# EAGLE design ha-pc-switch-revB (EAGLE 9.6.2)

## Sheet 1 of 2
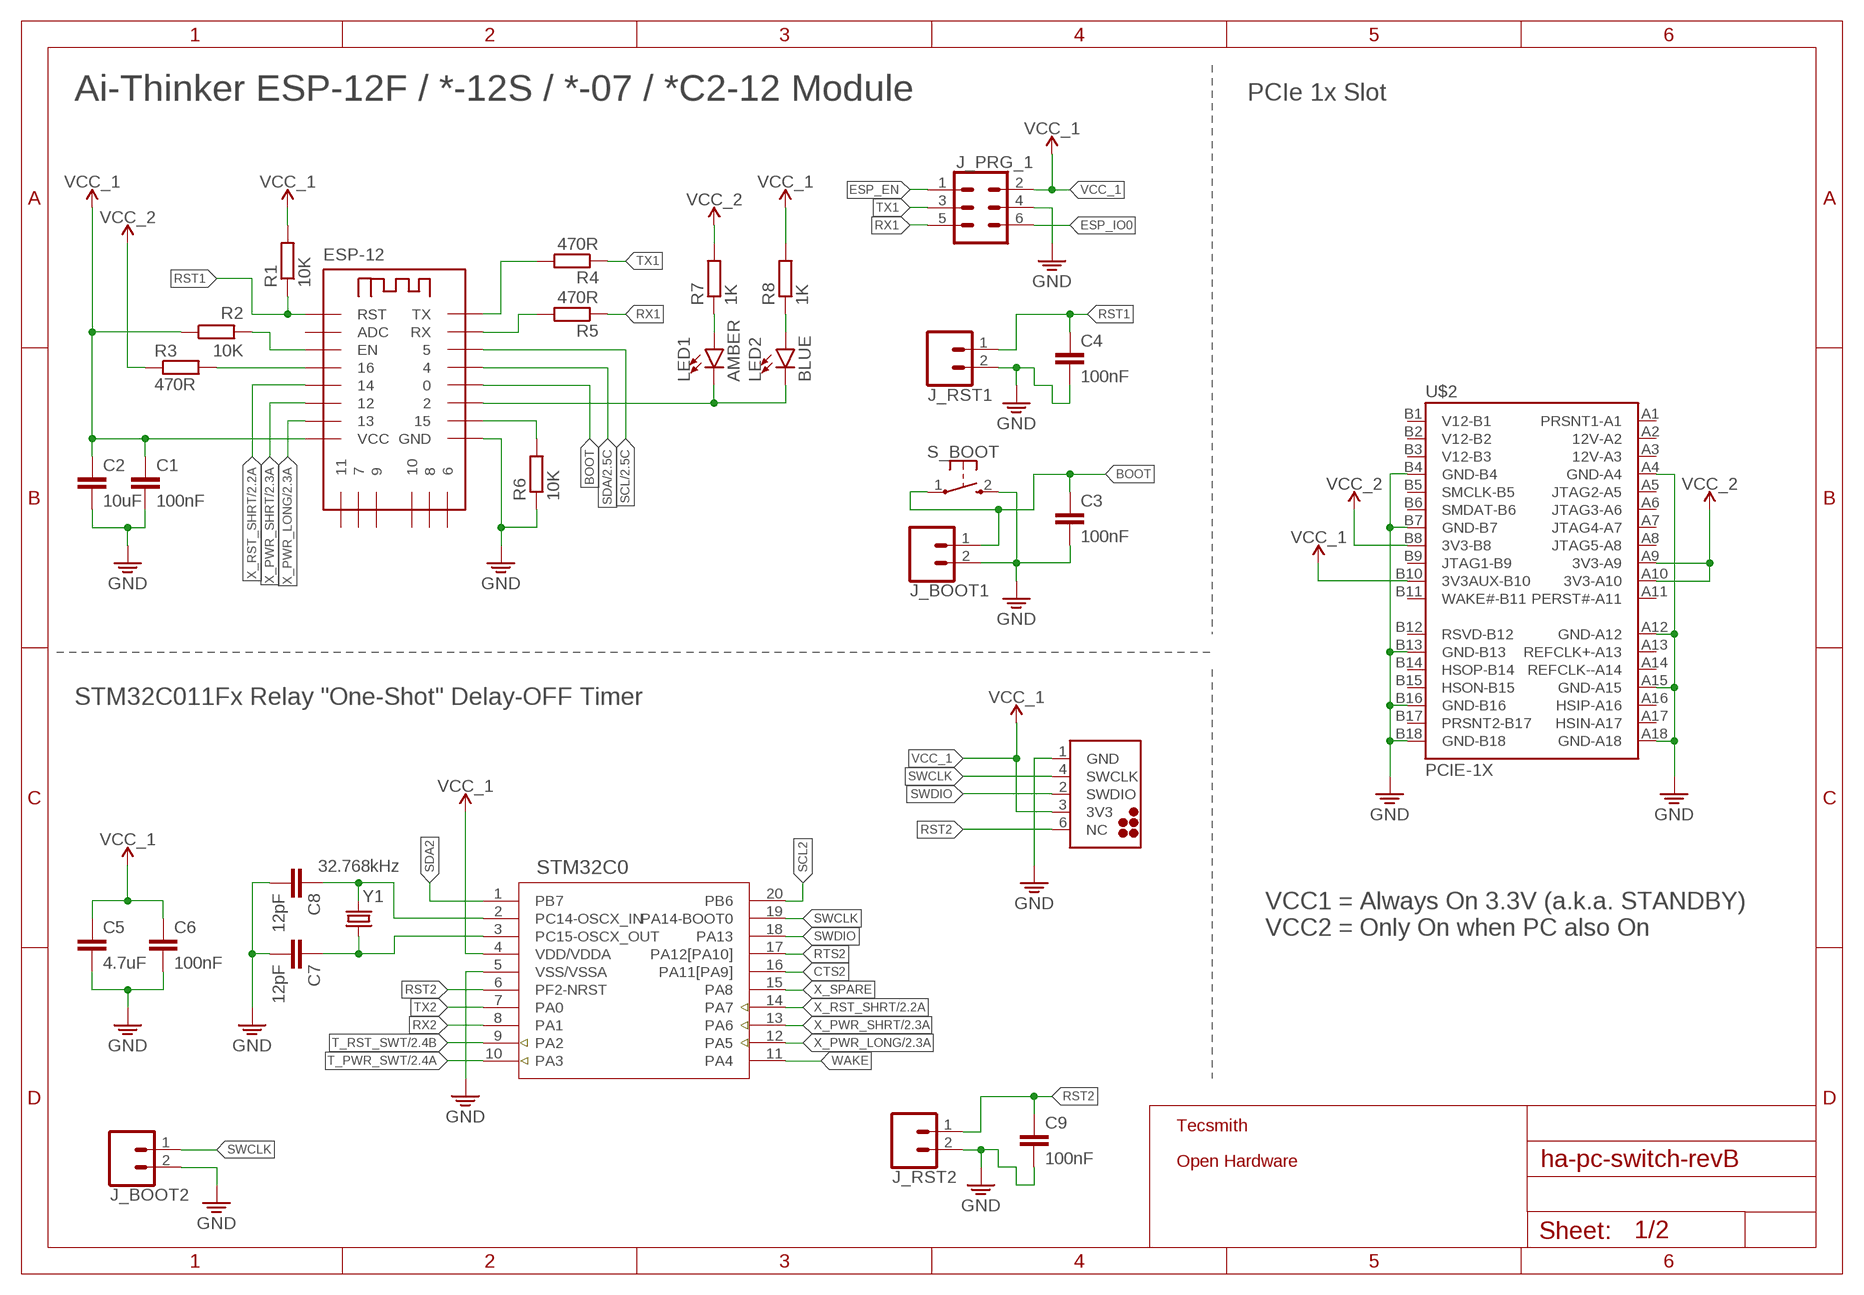
[diagram p0: schematic, sheet 1]

### Parts
C1  100nF  C-EUC0603  [C0603]
C2  10uF  C-EUC0603  [C0603]
C3  100nF  C-EUC0603  [C0603]
C4  100nF  C-EUC0603  [C0603]
C5  4.7uF  C-EUC0603  [C0603]
C6  100nF  C-EUC0603  [C0603]
C7  12pF  C-EUC0603  [C0603]
C8  12pF  C-EUC0603  [C0603]
C9  100nF  C-EUC0603  [C0603]
ESP-12  ESPRESSIF-ESP-12F&ESMD  [ESP8266-ESP-12E]
J_BOOT1  CONN_021X02_NO_SILK  [1X02_NO_SILK]
J_BOOT2  CONN_021X02_NO_SILK  [1X02_NO_SILK]
J_PRG2  NUCLEO_HEADER  [NUCLEO]
J_PRG_1  CONN_03X2NO_SILK  [2X3-NS]
J_RST1  CONN_021X02_NO_SILK  [1X02_NO_SILK]
J_RST2  CONN_021X02_NO_SILK  [1X02_NO_SILK]
LED1  AMBER  LED-GREEN0603  [LED-0603]
LED2  BLUE  LED-GREEN0603  [LED-0603]
LOGO1  OSHW-LOGOM  [OSHW-LOGO-M]
R1  10K  R-EU_R0603  [R0603]
R2  10K  R-EU_R0603  [R0603]
R3  470R  R-EU_R0603  [R0603]
R4  470R  R-EU_R0603  [R0603]
R5  470R  R-EU_R0603  [R0603]
R6  10K  R-EU_R0603  [R0603]
R7  1K  R-EU_R0603  [R0603]
R8  1K  R-EU_R0603  [R0603]
S_BOOT  MOMENTARY-SWITCH-SPST-1  [SKRKAEE020]
STM32C0  STM32C011FTSSOP20_STM-M  [TSSOP20-M]
U$1  TECSMITH-LOGOLONG  [TECSMITH-NAME]
U$2  PCIE-1X  [PCIE-1X]
Y1  32.768kHz  CRYSTAL-32.768KHZSMD-3.2X1.5  [CRYSTAL-SMD-3.2X1.5MM]

### Nets
BOOT: C3.1 ESP-12.GPIO0 J_BOOT1.1 S_BOOT.1
CTS2: STM32C0.16(PA11[PA9])
ESP_EN: ESP-12.EN J_PRG_1.1 R2.2
ESP_IO0: J_PRG_1.6
GND: C1.2 C2.2 C3.2 C4.2 C5.2 C6.2 C7.2 C8.2 C9.2 ESP-12.GND J_BOOT1.2 J_BOOT2.2 J_PRG2.1(GND) J_PRG_1.4 J_RST1.2 J_RST2.2 R6.1 S_BOOT.2 STM32C0.5(VSS/VSSA) U$2.A4(GND-A4) U$2.A12(GND-A12) U$2.A15(GND-A15) U$2.A18(GND-A18) U$2.B4(GND-B4) U$2.B7(GND-B7) U$2.B13(GND-B13) U$2.B16(GND-B16) U$2.B18(GND-B18) ; also sheet 2
N$1: ESP-12.GPIO16 R3.2
N$2: LED2.A R8.1
N$10: C8.1 STM32C0.2(PC14-OSCX_IN) Y1.P$2
N$11: C7.1 STM32C0.3(PC15-OSCX_OUT) Y1.P$1
N$14: LED1.A R7.1
N$15: ESP-12.RXD0(RX) R5.2
N$16: ESP-12.GPIO2 LED1.C LED2.C
N$23: ESP-12.TXD0(TX) R4.2
N$24: ESP-12.GPIO15 R6.2
RST1: C4.1 ESP-12.RST J_RST1.1 R1.1
RST2: C9.1 J_PRG2.6(NC) J_RST2.1 STM32C0.6(PF2-NRST)
RTS2: STM32C0.17(PA12[PA10])
RX1: J_PRG_1.5 R5.1
RX2: STM32C0.8(PA1)
SCL: ESP-12.GPIO5 ; also sheet 2
SCL2: STM32C0.20(PB6)
SDA: ESP-12.GPIO4 ; also sheet 2
SDA2: STM32C0.1(PB7)
SWCLK: J_BOOT2.1 J_PRG2.4(SWCLK) STM32C0.19(PA14-BOOT0)
SWDIO: J_PRG2.2(SWDIO) STM32C0.18(PA13)
T_PWR_SWT: STM32C0.10(PA3) ; also sheet 2
T_RST_SWT: STM32C0.9(PA2) ; also sheet 2
TX1: J_PRG_1.3 R4.1
TX2: STM32C0.7(PA0)
VCC_1: C1.1 C2.1 C5.1 C6.1 ESP-12.VCC J_PRG2.3(3V3) J_PRG_1.2 R1.2 R2.1 R8.2 STM32C0.4(VDD/VDDA) U$2.B10(3V3AUX-B10) ; also sheet 2
VCC_2: R3.1 R7.2 U$2.A9(3V3-A9) U$2.A10(3V3-A10) U$2.B8(3V3-B8)
WAKE: STM32C0.11(PA4)
X_PWR_LONG: ESP-12.GPIO13 STM32C0.12(PA5) ; also sheet 2
X_PWR_SHRT: ESP-12.GPIO12 STM32C0.13(PA6) ; also sheet 2
X_RST_SHRT: ESP-12.GPIO14 STM32C0.14(PA7) ; also sheet 2
X_SPARE: STM32C0.15(PA8)
Unconnected: ESP-12.ADC0(ADC) ESP-12.CS0 ESP-12.GPIO9 ESP-12.GPIO10 ESP-12.MISO ESP-12.MOSI ESP-12.SCLK U$2.A1(PRSNT1-A1) U$2.A2(12V-A2) U$2.A3(12V-A3) U$2.A5(JTAG2-A5) U$2.A6(JTAG3-A6) U$2.A7(JTAG4-A7) U$2.A8(JTAG5-A8) U$2.A11(PERST#-A11) U$2.A13(REFCLK+-A13) U$2.A14(REFCLK--A14) U$2.A16(HSIP-A16) U$2.A17(HSIN-A17) U$2.B1(V12-B1) U$2.B2(V12-B2) U$2.B3(V12-B3) U$2.B5(SMCLK-B5) U$2.B6(SMDAT-B6) U$2.B9(JTAG1-B9) U$2.B11(WAKE#-B11) U$2.B12(RSVD-B12) U$2.B14(HSOP-B14) U$2.B15(HSON-B15) U$2.B17(PRSNT2-B17)

### Notes on the sheet
- Ai-Thinker ESP-12F / *-12S / *-07 / *C2-12 Module | PCIe 1x Slot
- STM32C011Fx Relay "One-Shot" Delay-OFF Timer
- VCC1 = Always On 3.3V (a.k.a. STANDBY)
  VCC2 = Only On when PC also On

## Sheet 2 of 2
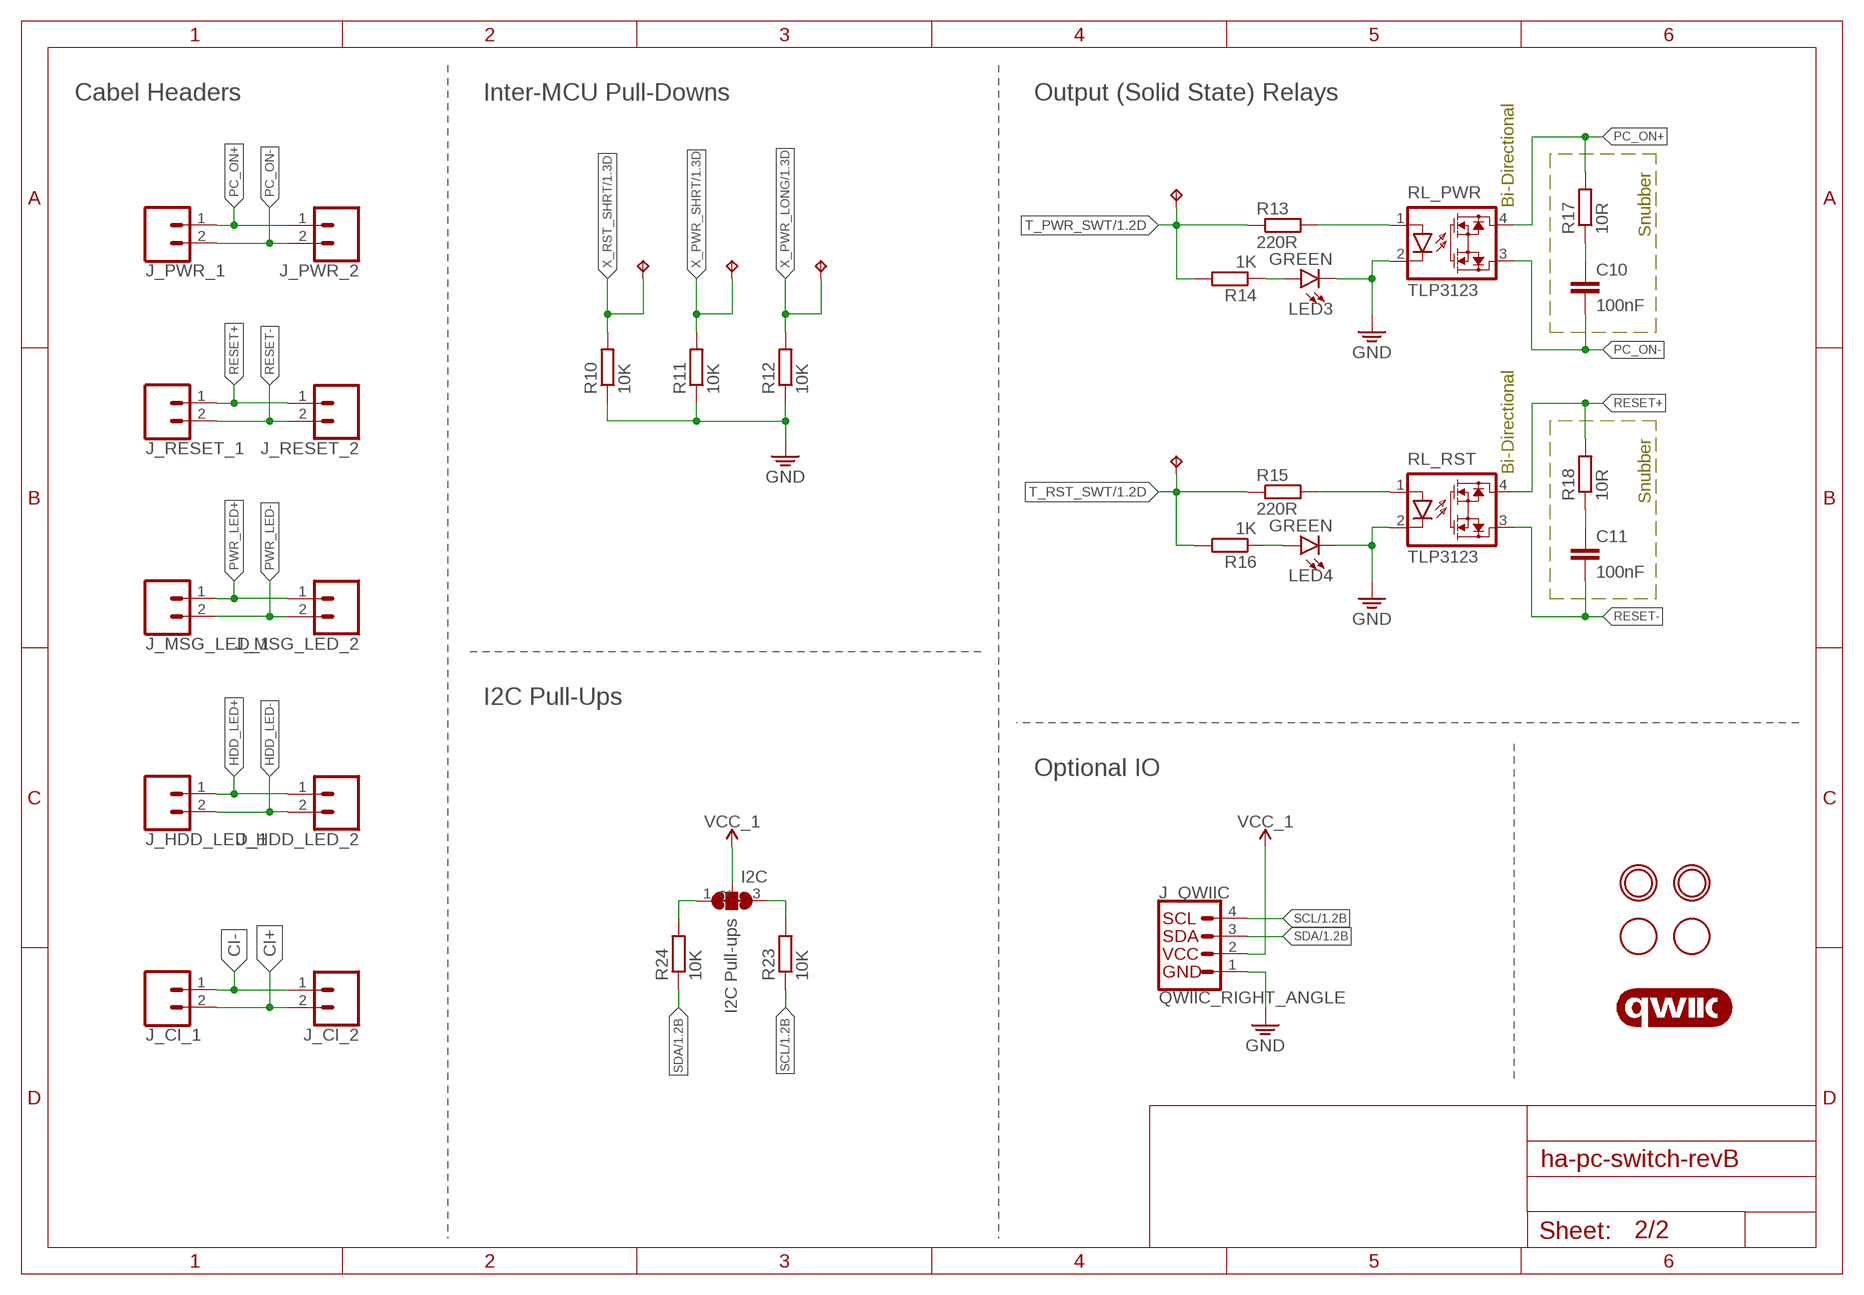
[diagram p1: schematic, sheet 2]

### Parts
C10  100nF  C-EUC0603  [C0603]
C11  100nF  C-EUC0603  [C0603]
I2C  JUMPER-1X3-CLOSED-2  [SOLDERJUMPER_CLOSEDWIRE-3-2]
J_CI_1  CONN_021X02_NO_SILK  [1X02_NO_SILK]
J_CI_2  CONN_021X02_NO_SILK  [1X02_NO_SILK]
J_HDD_LED_1  CONN_021X02_NO_SILK  [1X02_NO_SILK]
J_HDD_LED_2  CONN_021X02_NO_SILK  [1X02_NO_SILK]
J_MSG_LED_1  CONN_021X02_NO_SILK  [1X02_NO_SILK]
J_MSG_LED_2  CONN_021X02_NO_SILK  [1X02_NO_SILK]
J_PWR_1  CONN_021X02_NO_SILK  [1X02_NO_SILK]
J_PWR_2  CONN_021X02_NO_SILK  [1X02_NO_SILK]
J_QWIIC  QWIIC_RIGHT_ANGLE  QWIIC_CONNECTORJS-1MM  [JST04_1MM_RA]
J_RESET_1  CONN_021X02_NO_SILK  [1X02_NO_SILK]
J_RESET_2  CONN_021X02_NO_SILK  [1X02_NO_SILK]
LED3  GREEN  LED-GREEN0603  [LED-0603]
LED4  GREEN  LED-GREEN0603  [LED-0603]
LOGO2  QWIIC_LOGO_4MM  [QWIIC_4MM]
R10  10K  R-EU_R0603  [R0603]
R11  10K  R-EU_R0603  [R0603]
R12  10K  R-EU_R0603  [R0603]
R13  220R  R-EU_R0603  [R0603]
R14  1K  R-EU_R0603  [R0603]
R15  220R  R-EU_R0603  [R0603]
R16  1K  R-EU_R0603  [R0603]
R17  10R  R-EU_R0603  [R0603]
R18  10R  R-EU_R0603  [R0603]
R23  10K  R-EU_R0603  [R0603]
R24  10K  R-EU_R0603  [R0603]
RL_PWR  TLP3123  [SOP4_TOS]
RL_RST  TLP3123  [SOP4_TOS]
TP6  TPTP16SQ  [TP16SQ]
TP7  TPTP16SQ  [TP16SQ]
TP8  TPTP16SQ  [TP16SQ]
TP9  TPTP16SQ  [TP16SQ]
TP10  TPTP16SQ  [TP16SQ]
U$9  MOUNTINGHOLE3.0THIN  [MOUNTINGHOLE_3.0_PLATEDTHIN]
U$11  MOUNTINGHOLE3.0THIN  [MOUNTINGHOLE_3.0_PLATEDTHIN]
U$15  FIDUCIAL  [FIDUCIAL_1MM]
U$16  FIDUCIAL  [FIDUCIAL_1MM]

### Nets
CI+: J_CI_1.2 J_CI_2.2
CI-: J_CI_1.1 J_CI_2.1
GND: J_QWIIC.1 LED3.C LED4.C R10.1 R11.1 R12.1 RL_PWR.2(C) RL_RST.2(C) ; also sheet 1
HDD_LED+: J_HDD_LED_1.1 J_HDD_LED_2.1
HDD_LED-: J_HDD_LED_1.2 J_HDD_LED_2.2
N$5: R15.2 RL_RST.1(A)
N$7: C10.1 R17.1
N$8: C11.1 R18.1
N$9: R13.2 RL_PWR.1(A)
N$19: LED3.A R14.1
N$20: I2C.3 R23.2
N$21: I2C.1 R24.2
N$25: LED4.A R16.1
PC_ON+: J_PWR_1.1 J_PWR_2.1 R17.2 RL_PWR.4(D1)
PC_ON-: C10.2 J_PWR_1.2 J_PWR_2.2 RL_PWR.3(D2)
PWR_LED+: J_MSG_LED_1.1 J_MSG_LED_2.1
PWR_LED-: J_MSG_LED_1.2 J_MSG_LED_2.2
RESET+: J_RESET_1.1 J_RESET_2.1 R18.2 RL_RST.4(D1)
RESET-: C11.2 J_RESET_1.2 J_RESET_2.2 RL_RST.3(D2)
SCL: J_QWIIC.4 R23.1 ; also sheet 1
SDA: J_QWIIC.3 R24.1 ; also sheet 1
T_PWR_SWT: R13.1 R14.2 TP9.TP ; also sheet 1
T_RST_SWT: R15.1 R16.2 TP10.TP ; also sheet 1
VCC_1: I2C.2 J_QWIIC.2 ; also sheet 1
X_PWR_LONG: R12.2 TP8.TP ; also sheet 1
X_PWR_SHRT: R11.2 TP7.TP ; also sheet 1
X_RST_SHRT: R10.2 TP6.TP ; also sheet 1

### Notes on the sheet
- Cabel Headers | Inter-MCU Pull-Downs | Output (Solid State) Relays
- Snubber
- Bi-Directional
- Snubber
- Bi-Directional
- I2C Pull-Ups
- Optional IO
- I2C Pull-ups

## Library data of the parts
C1-C11 = rcl:C-EU: CAPACITOR, European symbol; SPICEPREFIX: C
ESP-12 = ts_dev_boards:ESPRESSIF-ESP-12F&E: ESP12E Module
I2C = ts_jumpers:JUMPER-1X3-CLOSED-2
J_BOOT1 J_BOOT2 J_CI_1 J_CI_2 J_HDD_LED_1 J_HDD_LED_2 J_MSG_LED_1 J_MSG_LED_2 J_PWR_1 J_PWR_2 J_RESET_1 J_RESET_2 J_RST1 J_RST2 = SparkFun-Connectors:CONN_02: Multi connection point. Often used as Generic Header-pin footprint for 0.1 inch spaced/style header connections On any of the 0.1 inch spaced packages, you can populate with these: Break Away Headers - Straight <https://www.sparkfun.com/products/116> (PRT-00116) Break Away Male Headers - Right Angle <https://www.sparkfun.com/products/553> (PRT-00553) Female Headers <https://www.sparkfun.com/products/115> (PRT-00115) Break Away Headers - Machine Pin <https://www.sparkfun.com/products/117> (PRT-00117) Break Away Female Headers - Swiss Machine Pin <https://www.sparkfun.com/products/743> (PRT-00743) For SCREWTERMINALS and SPRING TERMINALS visit here: Screw Terimnals on SparkFun.com <https://www.sparkfun.com/search/results?term=Screw+Terminals> (5mm/3.5mm/2.54mm spacing) This device is also useful as a general connection point to wire up your design to another part of your project. Our various solder wires solder well into these plated through hole pads. Hook-Up Wire - Assortment (Stranded, 22 AWG) <https://www.sparkfun.com/products/11375> (PRT-11375) Hook-Up Wire - Assortment (Solid Core, 22 AWG) <https://www.sparkfun.com/products/11367> (PRT-11367) View the entire wire category on our website here <https://www.sparkfun.com/categories/141> Special notes: Molex polarized connector foot print use with: PRT-08233 with associated crimp pins and housings. 2.54_SCREWTERM for use with PRT-10571. 3.5mm Screw Terminal footprints for PRT-08084 5mm Screw Terminal footprints for use with PRT-08432
J_PRG2 = stm32c0:NUCLEO_HEADER
J_PRG_1 = SparkFun-Connectors:CONN_03X2: Multi connection point. Often used as Generic Header-pin footprint for 0.1 inch spaced/style header connections You can populate with any combo of single row headers, but if you'd like an exact match, check these: Header - 2x3 (Male, 0.1") <https://www.sparkfun.com/products/12807> (PRT-12807) Header - 2x3 (Female, 0.1") <https://www.sparkfun.com/products/13010> (PRT-13010) 2x3 Pin Shrouded Header <https://www.sparkfun.com/products/10877> (PRT-10877) On any of the 0.1 inch spaced packages, you can populate with these: Break Away Headers - Straight <https://www.sparkfun.com/products/116> (PRT-00116) Break Away Male Headers - Right Angle <https://www.sparkfun.com/products/553> (PRT-00553) Female Headers <https://www.sparkfun.com/products/115> (PRT-00115) Break Away Headers - Machine Pin <https://www.sparkfun.com/products/117> (PRT-00117) Break Away Female Headers - Swiss Machine Pin <https://www.sparkfun.com/products/743> (PRT-00743) Special note: the shrouded connector mates well with our 3x2 ribbon cables: Ribbon Crimp Connector - 6-pin (2x3, Female) <https://www.sparkfun.com/products/10651> (PRT-10651) Ribbon Cable - 6 wire (15ft) <https://www.sparkfun.com/products/10646> (PRT-10646)
J_QWIIC = ts_custom_nick_nacks:QWIIC_CONNECTOR: SparkFun I2C Standard Qwiic Connector An SMD 1mm pitch JST connector makes it easy and quick (get it? Qwiic?) to connect I2C devices to each other. The Qwiic system <http://www.sparkfun.com/qwiic> enables fast and solderless connection between popular platforms and various sensors and actuators. We carry 200mm <https://www.sparkfun.com/products/14204>, 100mm <https://www.sparkfun.com/products/14205>, 50mm <https://www.sparkfun.com/products/14206>, and breadboard friendly <https://www.sparkfun.com/products/14207> Qwiic cables. We also offer 10 pcs strips <https://www.sparkfun.com/products/14323> the SMD connectors.; PROD_ID: CONN-13694
LED1 LED2 = SparkFun-LED:LED-GREEN: Green SMD LED Used in manufacturing of various products at SparkFun Packages: 0603 - SMD 0603 package [Product Link] <http://www.futureelectronics.com/en/technologies/semiconductors/optoelectronics/leds/Pages/9894312-LTST-C190GKT.aspx?CrossPart=HSMG-C190&IM=0> LilyPad 1206 - SMD1206 LilyPad package [Product Link] <http://www.futureelectronics.com/en/Technologies/Product.aspx?ProductID=IN150NGHARVATEKCORPORATION2049943&IM=0> 1206 - SMD1206 package [Product Link] <http://www.futureelectronics.com/en/technologies/semiconductors/optoelectronics/leds/Pages/8315665-LTST-C150KGKT.aspx?IM=0> 1206 Bottom Mount -SMD 1206 Bottom Mount [Product Link] <http://www.digikey.com/product-detail/en/lite-on-inc/LTST-C230KGKT/160-1456-1-ND/386854> SparkFun Products: Pro Mini 328 -5V <https://www.sparkfun.com/products/821> RedBoard <https://www.sparkfun.com/products/12757> MP3 Trigger <https://www.sparkfun.com/products/13720> Makey Makey <https://www.sparkfun.com/products/11076>; PROD_ID: DIO-00821; VALUE: GREEN
LED3 LED4 = SparkFun-LED:LED-GREEN: Green SMD LED Used in manufacturing of various products at SparkFun Packages: 0603 - SMD 0603 package [Product Link] <http://www.futureelectronics.com/en/technologies/semiconductors/optoelectronics/leds/Pages/9894312-LTST-C190GKT.aspx?CrossPart=HSMG-C190&IM=0> LilyPad 1206 - SMD1206 LilyPad package [Product Link] <http://www.futureelectronics.com/en/Technologies/Product.aspx?ProductID=IN150NGHARVATEKCORPORATION2049943&IM=0> 1206 - SMD1206 package [Product Link] <http://www.futureelectronics.com/en/technologies/semiconductors/optoelectronics/leds/Pages/8315665-LTST-C150KGKT.aspx?IM=0> 1206 Bottom Mount -SMD 1206 Bottom Mount [Product Link] <http://www.digikey.com/product-detail/en/lite-on-inc/LTST-C230KGKT/160-1456-1-ND/386854> SparkFun Products: Pro Mini 328 -5V <https://www.sparkfun.com/products/821> RedBoard <https://www.sparkfun.com/products/12757> MP3 Trigger <https://www.sparkfun.com/products/13720> Makey Makey <https://www.sparkfun.com/products/11076>; PROD_ID: DIO-00821
LOGO1 = random_logos:OSHW-LOGO: Open-Source Hardware (OSHW) Logo This logo indicates the piece of hardware it is found on incorporates a OSHW license and/or adheres to the definition of open source hardware found here: http://freedomdefined.org/OSHW
LOGO2 = SparkFun-Aesthetics:QWIIC_LOGO: Qwiic Logos for placement on schematic and PCB. The 5.5mm silk logo is best for placing next to Qwiic connector.
R1-R8 R10-R18 R23 R24 = rcl:R-EU_: RESISTOR, European symbol; SPICEPREFIX: R
RL_PWR RL_RST = __untitled:TLP3123
S_BOOT = ts_custom_nick_nacks:MOMENTARY-SWITCH-SPST-1: Momentary Switch (Pushbutton) - SPST - Two Circuits Normally-open (NO) SPST momentary switches (buttons, pushbuttons). Schematic symbol includes two switch circuits. Variants SMD-4.6MMX2.8MM - 4.60mm x 2.80mm Tactile Momentary Button Switch - Used on SparkFun SAMD21 Mini Breakout <https://www.sparkfun.com/products/13664> SMD-5.2MM - Mini Pushbutton Switch - SMD <https://www.sparkfun.com/products/8720> - Used on Arduino Pro Mini <https://www.sparkfun.com/products/11114>
STM32C0 = stm32c0:STM32C011F; COPYRIGHT: Copyright (C) 2024 Ultra Librarian. All rights reserved.; MANUFACTURER_PART_NUMBER: STM32C011F4P6; MFR_NAME: STMicroelectronics
TP6-TP10 = testpad:TP: Test pad
U$1 = random_logos:TECSMITH-LOGO
U$2 = ts-pcie:PCIE-1X
U$9 U$11 = ts_custom_nick_nacks:MOUNTINGHOLE: Mounting Hole For #2 screws (0.086"/2.18mm width, 0.094"/2.4mm hole) use 2.5mm; BOM: EXCLUDE
U$15 U$16 = adafruit:FIDUCIAL: For use by pick and place machines to calibrate the vision/machine, 1mm By microbuilder.eu
Y1 = SparkFun-Clocks:CRYSTAL-32.768KHZ: 32.768kHz Crystal Frequency: 32.768kHz Frequency Stability: ±20ppm Load Capacitance: 12.5pF (PTH-2X6 & SMD-3.2X1.5), 6pF (SMD-2X6) SparkFun Products: SparkFun BigTime Watch Kit <https://www.sparkfun.com/products/11734> SparkFun nRF52832 Breakout <https://www.sparkfun.com/products/13990> SparkFun Real Time Clock Module <https://www.sparkfun.com/products/12708>; PROD_ID: XTAL-13062

## Board
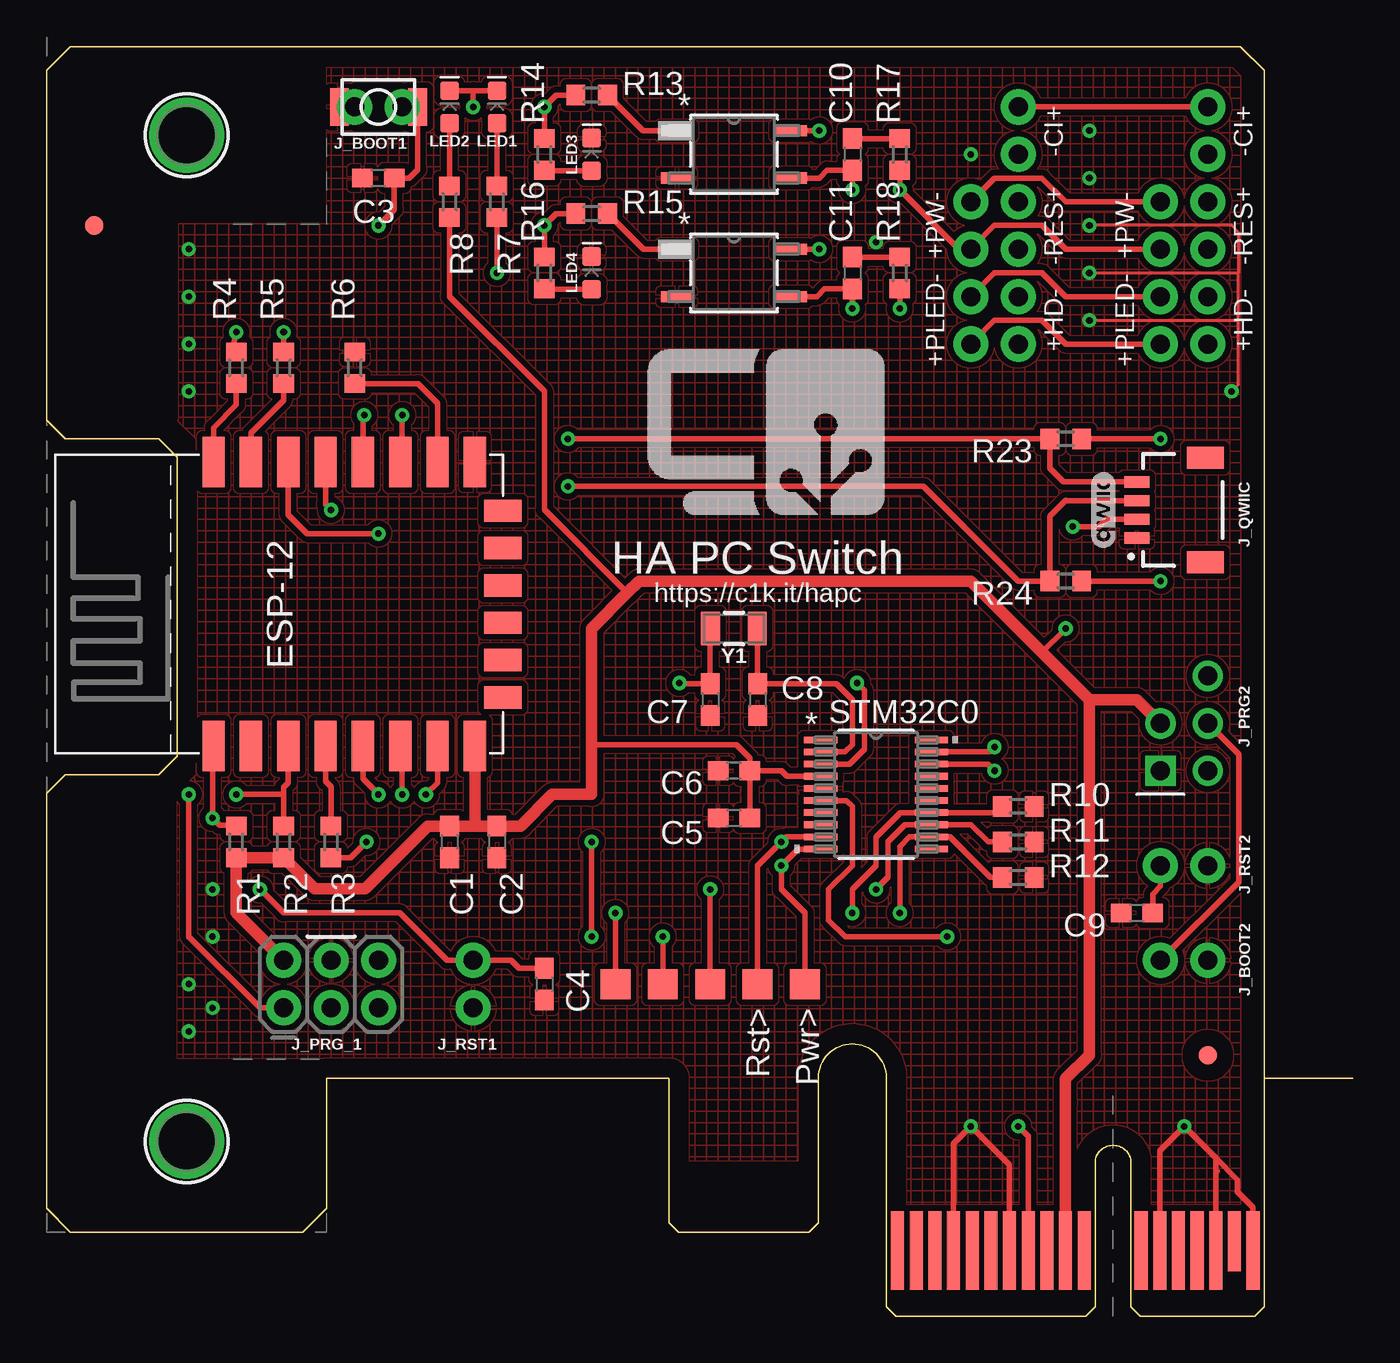
[diagram p2: board, top side]
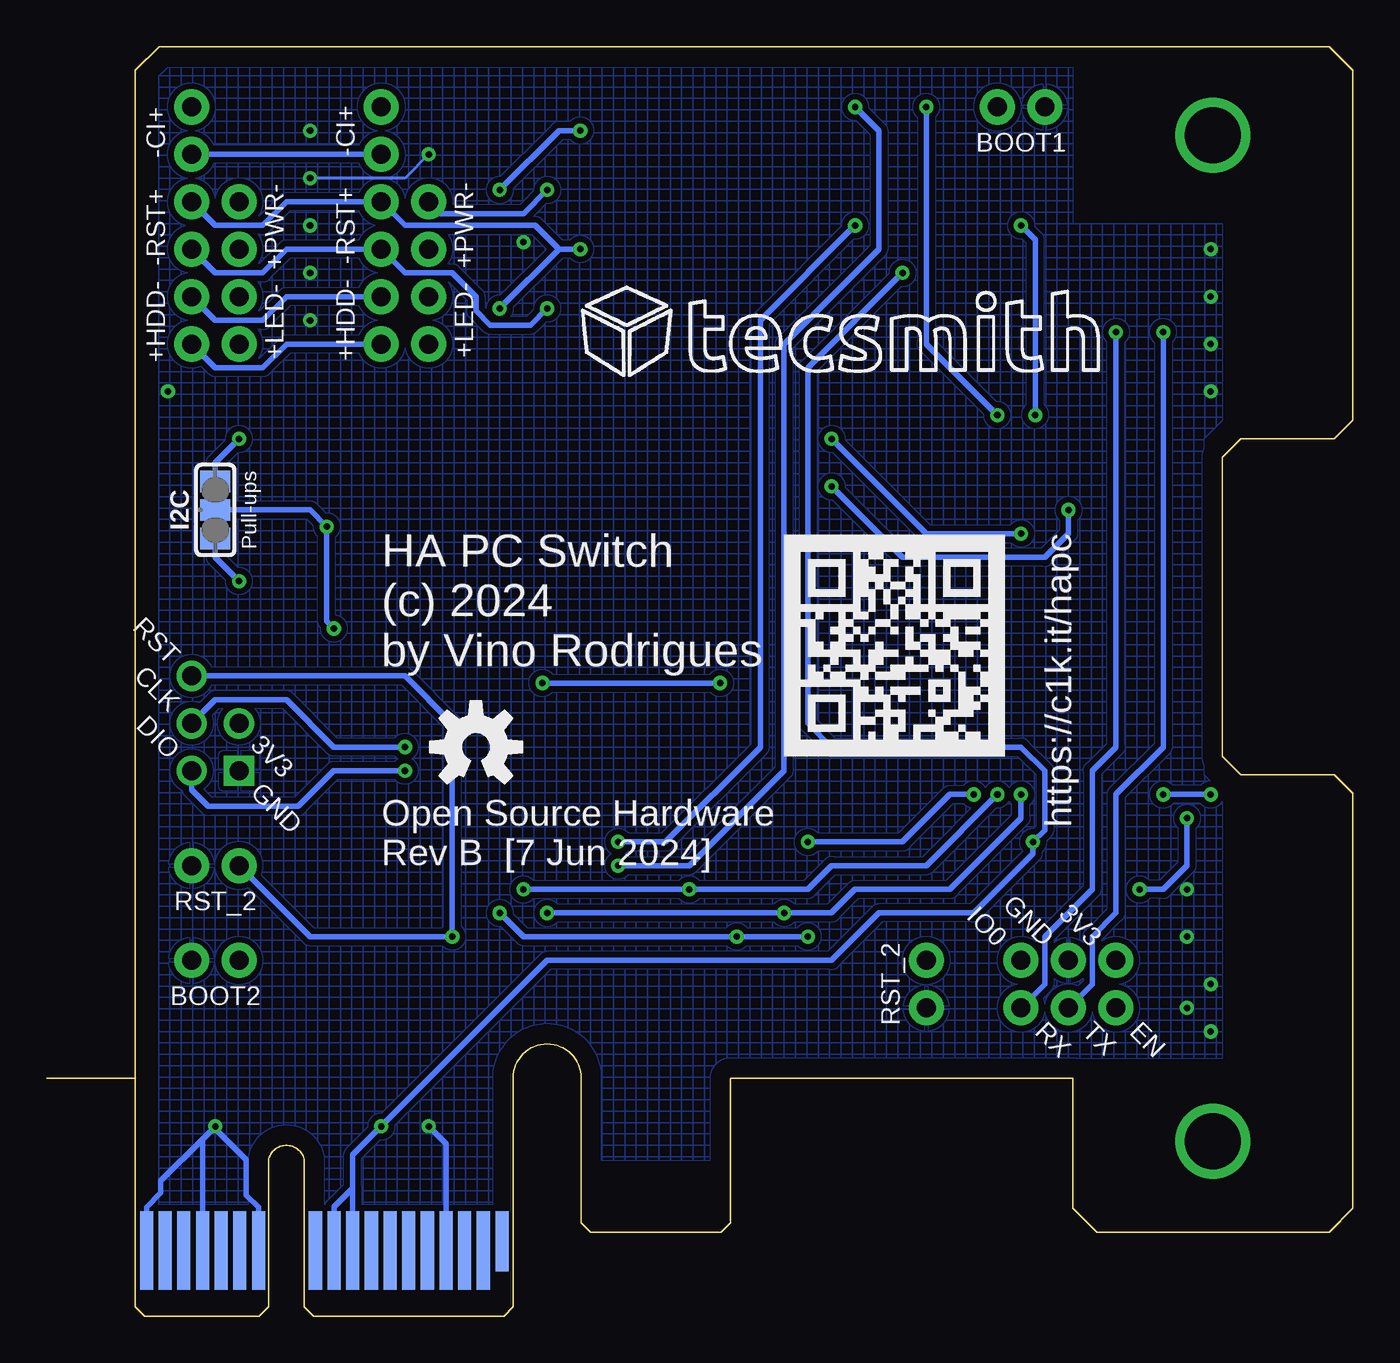
[diagram p3: board, bottom side, seen from below]

Size 70 x 68 mm. Coordinates in mm from the lower left corner, seen from the top.
Outline: 65.25,12.75 65.25,66.73 63.98,68 1.27,68 0,66.73 0,48 1,47 6,47 7,46 7,30 6,29 1,29 0,28 0,5.77 1.27,4.5 13.73,4.5 15,5.77 15,12.75 33.35,12.75 33.35,5 33.85,4.5 40.85,4.5 41.35,5 41.35,12.75 arc-180 45,12.75 45,0.5 45.5,0 55.7,0 56.2,0.5 56.2,8.4 arc-152 58.1,8.4 58.1,0.5 58.6,0 64.75,0 65.25,0.5 65.25,12.75
Outline: 65.25,12.75 70,12.75
Copper layers (1*16): Top 0.035mm / dielectric 1.5mm / Bottom 0.035mm
Design rules "default": minimum track width 6mil, minimum drill 0.35mm, track to track 6mil, track to pad 6mil, pad to pad 6mil, via to via 6mil, smd to smd 6mil, copper to edge 40mil, drill to drill 6mil, minimum pad ring 10mil, minimum via ring 8mil, stop-mask expansion 4mil, vias tented up to drill 0mil, thermal gap 10mil

### Footprints (pad centres in the part's own frame; a part is rotated, then mirrored left to right if it is on the bottom)
C0603 = smd 1.1 x 1: 1 -0.85,0; 2 0.85,0
ESP8266-ESP-12E = smd 2.7 x 1.2: ADC0 -7.6,3.5; EN -7.6,1.5; GND 7.6,-8.5; GPIO0 7.6,-2.5; GPIO2 7.6,-4.5; GPIO4 7.6,-0.5; GPIO5 7.6,1.5; GPIO12 -7.6,-4.5; GPIO13 -7.6,-6.5; GPIO14 -7.6,-2.5; GPIO15 7.6,-6.5; GPIO16 -7.6,-0.5; RST -7.6,5.5; RXD0 7.6,3.5; TXD0 7.6,5.5; VCC -7.6,-8.5 | smd 1.2 x 2: CS0 -5,-10; GPIO9 -1,-10; GPIO10 1,-10; MISO -3,-10; MOSI 3,-10; SCLK 5,-10
SOLDERJUMPER_CLOSEDWIRE-3-2 = smd 1.168 x 1.6: 1 -1.524,0; 2 0,0; 3 1.524,0 | smd 0.635 x 0.203: WIRE1 -0.762,0; WIRE2 0.762,0
1X02_NO_SILK = drill 1.016 pad 1.88: 1 0,0; 2 2.54,0
NUCLEO = drill 1.016 pad 1.626 square: 1 -1.27,-1.27 | drill 1.016 pad 1.626: 2 1.27,-1.27; 3 -1.27,1.27; 4 1.27,1.27; 6 1.27,3.81
2X3-NS = drill 1.016 pad 1.88: 1 -2.54,-1.27; 2 -2.54,1.27; 3 0,-1.27; 4 0,1.27; 5 2.54,-1.27; 6 2.54,1.27
JST04_1MM_RA = smd 0.6 x 1.35: 1 -1.5,0; 2 -0.5,0; 3 0.5,0; 4 1.5,0 | smd 1.2 x 2: NC1 2.8,-3.675; NC2 -2.8,-3.675
LED-0603 = smd 1 x 1: A -0.877,0; C 0.877,0
R0603 = smd 1 x 1.1: 1 -0.85,0; 2 0.85,0
SOP4_TOS = smd 1.7 x 0.6: 1 -3.061,1.27; 2 -3.061,-1.27; 3 3.061,-1.27; 4 3.061,1.27
SKRKAEE020 = smd 1 x 2: 1 -2.1,0; 2 2.1,0
TSSOP20-M = smd 1.778 x 0.356: 1 -2.972,2.925; 2 -2.972,2.275; 3 -2.972,1.625; 4 -2.972,0.975; 5 -2.972,0.325; 6 -2.972,-0.325; 7 -2.972,-0.975; 8 -2.972,-1.625; 9 -2.972,-2.275; 10 -2.972,-2.925; 11 2.972,-2.925; 12 2.972,-2.275; 13 2.972,-1.625; 14 2.972,-0.975; 15 2.972,-0.325; 16 2.972,0.325; 17 2.972,0.975; 18 2.972,1.625; 19 2.972,2.275; 20 2.972,2.925
TP16SQ = smd 1.6 x 1.6: TP 0,0
PCIE-1X = smd 0.7 x 3.2 bottom: A1 45.6,4 | smd 0.7 x 4.2 bottom: A2 46.6,3.5; A3 47.6,3.5; A4 48.6,3.5; A5 49.6,3.5; A6 50.6,3.5; A7 51.6,3.5; A8 52.6,3.5; A9 53.6,3.5; A10 54.6,3.5; A11 55.6,3.5; A12 58.65,3.5; A13 59.65,3.5; A14 60.65,3.5; A15 61.65,3.5; A16 62.65,3.5; A17 63.65,3.5; A18 64.65,3.5 | smd 0.7 x 4.2: B1 45.6,3.5; B2 46.6,3.5; B3 47.6,3.5; B4 48.6,3.5; B5 49.6,3.5; B6 50.6,3.5; B7 51.6,3.5; B8 52.6,3.5; B9 53.6,3.5; B10 54.6,3.5; B11 55.6,3.5; B12 58.65,3.5; B13 59.65,3.5; B14 60.65,3.5; B15 61.65,3.5; B16 62.65,3.5; B18 64.65,3.5 | smd 0.7 x 3.2: B17 63.65,4
MOUNTINGHOLE_3.0_PLATEDTHIN = drill 3 pad 3.6: P$1 0,0
FIDUCIAL_1MM = smd 1 x 1: 1 0,0
CRYSTAL-SMD-3.2X1.5MM = smd 1 x 1.8: P$1 -1.25,0; P$2 1.25,0

### Placement (x,y rotation side)
C1  21.59,25.4 270 top
C2  24.13,25.4 270 top
C3  17.78,60.96 180 top
C4  26.67,17.78 270 top
C5  36.83,26.67 180 top
C6  36.83,29.21 180 top
C7  35.56,33.02 270 top
C8  38.1,33.02 270 top
C9  58.42,21.59 180 top
C10  43.18,62.23 270 top
C11  43.18,55.88 270 top
ESP-12  14.45,38.14 90 top
I2C  60.96,43.18 90 bottom
J_BOOT1  19.05,64.77 180 top
J_BOOT2  59.69,19.05 0 top
J_CI_1  62.23,62.23 90 top
J_CI_2  52.07,62.23 90 top
J_HDD_LED_1  62.23,52.07 90 top
J_HDD_LED_2  52.07,52.07 90 top
J_MSG_LED_1  59.69,52.07 90 top
J_MSG_LED_2  49.53,52.07 90 top
J_PRG2  60.96,30.48 0 top
J_PRG_1  15.24,17.78 0 top
J_PWR_1  49.53,57.15 90 top
J_PWR_2  59.69,57.15 90 top
J_QWIIC  58.42,43.18 90 top
J_RESET_1  52.07,59.69 270 top
J_RESET_2  62.23,59.69 270 top
J_RST1  22.86,19.05 270 top
J_RST2  59.69,24.13 0 top
LED1  24.13,64.77 90 top
LED2  21.59,64.77 90 top
LED3  29.21,62.23 90 top
LED4  29.21,55.88 90 top
LOGO1  46.99,30.48 0 bottom
LOGO2  56.64,43.18 90 top
R1  10.16,25.4 270 top
R2  12.7,25.4 90 top
R3  15.24,25.4 90 top
R4  10.16,50.8 270 top
R5  12.7,50.8 270 top
R6  16.51,50.8 270 top
R7  24.13,59.69 270 top
R8  21.59,59.69 270 top
R10  52.07,27.3 180 top
R11  52.07,25.4 180 top
R12  52.07,23.5 180 top
R13  29.21,65.41 0 top
R14  26.67,62.23 90 top
R15  29.21,59.05 0 top
R16  26.67,55.88 90 top
R17  45.72,62.23 270 top
R18  45.72,55.88 270 top
R23  54.61,46.99 0 top
R24  54.61,39.37 0 top
RL_PWR  36.83,62.23 0 top
RL_RST  36.83,55.88 0 top
S_BOOT  17.78,64.77 180 top
STM32C0  44.45,27.94 0 top
TP6  30.48,17.78 0 top
TP7  35.56,17.78 0 top
TP8  33.02,17.78 0 top
TP9  40.64,17.78 0 top
TP10  38.1,17.78 0 top
U$1  38.92,52.87 0 bottom
U$2  0,0 0 top
U$9  7.5,9.35 0 top
U$11  7.5,63.25 0 top
U$15  62.23,13.97 0 top
U$16  2.54,58.42 0 top
Y1  36.83,36.83 0 top

### Tracks (layer width: path | path; a pad name or v marks a point on that pad's centre or on a via)
BOOT  (via drill 0.35)
  Top 0.305: J_BOOT1.1 S_BOOT.1 19.88,61.41 19.43,60.96 C3.1 18.63,59.27 v17.78,58.42 | ESP-12.GPIO0 16.95,48.19 v17.02,48.26
  Bottom 0.305: v17.02,48.26 17.02,57.66 v17.78,58.42
CI+
  Top 0.305: J_CI_2.2 J_CI_1.2
CI-
  Bottom 0.305: J_CI_2.1 J_CI_1.1
ESP_EN  (via drill 0.35)
  Top 0.305: ESP-12.EN 12.95,28.57 12.7,28.32 12.7,27.94 | 12.7,27.94 R2.2 | J_PRG_1.1 11.43,16.51 7.62,20.32 v7.62,27.94 | v10.16,27.94 12.7,27.94
  Bottom 0.305: v7.62,27.94 v10.16,27.94
GND  (via drill 0.35)
  Top 0.152: v63.5,49.53 63.87,49.9 63.87,53.34 | v55.88,58.42 63.5,58.42 63.88,58.04 63.88,55.88 v55.88,55.88 | 63.87,53.34 63.87,55.88 | v55.88,53.34 63.87,53.34
  Top 0.305: U$2.B18 64.65,5.83 63.82,6.67 63.82,7.3 62.65,8.47 | 16.38,64.77 S_BOOT.2 | U$2.B4 48.6,9.23 v49.53,10.16 51.6,8.09 U$2.B7 | 62.65,8.47 v60.96,10.16 59.65,8.85 U$2.B13 | U$2.B16 62.65,7.75 | 62.65,7.75 62.65,8.47 | 62.74,7.75 62.65,7.75
  Bottom 0.152: 61.59,6.35 61.65,6.29 61.7,6.35 | v49.53,62.23 50.8,60.96 v55.88,60.96
  Bottom 0.305: U$2.A15 61.65,6.29 61.65,9.47 | v49.53,10.16 48.6,9.23 U$2.B4 | v60.96,10.16 60.96,10.03 | 60.96,10.03 59.31,8.38 59.31,6.48 58.65,5.82 U$2.A12 | 61.65,9.47 63.88,7.24 63.88,6.6 64.65,5.83 U$2.B18 | 60.96,10.03 61.09,10.03 61.65,9.47
  other vias: 44.45,57.53 55.88,63.5 7.62,57.15 7.62,54.61 7.62,52.07 7.62,49.53 8.89,16.51 8.89,22.86 8.89,20.32 7.62,17.78 7.62,15.24
  pour Top (isolate 0.305, hatched): 15,67 64,67 64,6 58.49,6 58.49,9.24 55.76,9.24 55.76,6 45.37,6 45.37,14.62 41,14.62 41,8.1 33.7,8.1 33.7,13.8 7,13.8 7,28 8,29 8,47 7,48 7.08,48 7.08,58.51 15,58.51
  pour Bottom (isolate 0.305, hatched): 15,67 64,67 64,6 58.49,6 58.49,9.24 55.76,9.24 55.76,6 45.37,6 45.37,14.62 41,14.62 41,8.1 33.7,8.1 33.7,13.8 7,13.8 7,28 8,29 8,47 7,48 7,58.51 15,58.51
HDD_LED+
  Bottom 0.305: J_HDD_LED_1.1 60.96,50.8 58.42,50.8 57.15,52.07 J_HDD_LED_2.1
HDD_LED-
  Bottom 0.305: J_HDD_LED_1.2 60.96,53.34 58.42,53.34 57.15,54.61 J_HDD_LED_2.2
N$1
  Top 0.305: ESP-12.GPIO16 14.95,28.64 15.24,28.34 R3.2
N$2
  Top 0.305: R8.1 LED2.A
N$5
  Top 0.305: R15.2 30.09,59.05 31.99,57.15 RL_RST.1
N$7
  Top 0.305: C10.1 R17.1
N$8
  Top 0.305: C11.1 R18.1
N$9
  Top 0.305: R13.2 31.96,63.5 RL_PWR.1
N$10
  Top 0.305: Y1.P$2 38.1,36.81 C8.1 42.33,33.87 43.18,33.02 43.18,30.61 42.79,30.21 STM32C0.2
N$11  (via drill 0.35)
  Top 0.305: Y1.P$1 35.56,36.81 C7.1 33.95,33.87 v33.91,33.91 | STM32C0.3 43.03,29.57 43.81,30.35 43.81,33.53 v43.43,33.91
  Bottom 0.305: v43.43,33.91 v33.91,33.91
N$14
  Top 0.305: R7.1 LED1.A
N$15
  Top 0.305: ESP-12.RXD0 10.95,47.31 12.7,49.06 R5.2
N$16  (via drill 0.35)
  Top 0.305: v19.05,48.26 19.05,45.84 ESP-12.GPIO2 | LED2.C 22.86,65.65 | 22.86,65.65 LED1.C | 22.86,65.65 v22.86,64.77
  Bottom 0.305: v22.86,64.77 22.86,52.07 v19.05,48.26
N$19
  Top 0.305: LED3.A 26.7,61.35 R14.1
N$20  (via drill 0.35)
  Top 0.305: R23.2 v59.69,46.99
  Bottom 0.305: v59.69,46.99 60.96,45.72 I2C.3
N$21  (via drill 0.35)
  Top 0.305: v59.69,39.37 R24.2
  Bottom 0.305: I2C.1 60.96,40.64 v59.69,39.37
N$23
  Top 0.305: R4.2 10.16,48.81 8.95,47.6 ESP-12.TXD0
N$24
  Top 0.305: R6.2 19.9,49.95 20.95,48.9 ESP-12.GPIO15
N$25
  Top 0.305: LED4.A 26.7,55 R16.1
PC_ON+  (via drill 0.35)
  Top 0.305: R17.2 v45.72,60.33 48.9,57.15 J_PWR_1.1 50.8,58.42 53.34,58.42 54.61,57.15 J_PWR_2.1 | RL_PWR.4 v41.4,63.5
  Bottom 0.305: v45.72,60.33 42.55,63.5 v41.4,63.5
PC_ON-  (via drill 0.35)
  Top 0.305: J_PWR_1.2 50.8,60.96 53.34,60.96 54.61,59.69 J_PWR_2.2 | RL_PWR.3 41.4,60.96 41.82,61.38 C10.2 v43.18,60.33
  Bottom 0.305: v43.18,60.33 44.45,59.05 48.9,59.05 J_PWR_1.2
PWR_LED+
  Top 0.305: J_MSG_LED_2.1 50.8,53.34 53.34,53.34 54.61,52.07 J_MSG_LED_1.1
PWR_LED-
  Top 0.305: J_MSG_LED_1.2 54.61,54.61 53.34,55.88 50.8,55.88 J_MSG_LED_2.2
RESET+  (via drill 0.35)
  Top 0.305: RL_RST.4 v41.4,57.15 | v45.72,53.98 R18.2
  Bottom 0.305: J_RESET_2.1 60.96,58.42 58.42,58.42 57.15,59.69 J_RESET_1.1 50.8,58.42 43.81,58.42 42.55,57.15 | v41.4,57.15 42.55,57.15 | 42.55,57.15 v45.72,53.98
RESET-  (via drill 0.35)
  Top 0.305: RL_RST.3 41.27,54.61 41.7,55.03 C11.2 v43.18,53.98
  Bottom 0.305: J_RESET_2.2 60.96,55.88 58.42,55.88 57.15,57.15 J_RESET_1.2 50.8,55.88 48.26,55.88 46.99,54.61 46.99,53.85 46.23,53.09 44.07,53.09 v43.18,53.98
RST1  (via drill 0.35)
  Top 0.305: 10.22,26.31 R1.1 10.12,26.29 9.27,26.29 v8.89,26.67 8.89,30.48 ESP-12.RST | C4.1 25.31,18.63 24.89,19.05 J_RST1.1 21.46,19.05 18.92,21.59 12.7,21.59 v11.43,22.86
  Bottom 0.305: v8.89,26.67 8.89,24.13 10.16,22.86 v11.43,22.86
RST2  (via drill 0.35)
  Top 0.305: STM32C0.6 42.87,27.61 43.18,27.3 43.18,24.13 41.91,22.86 41.91,21.21 42.8,20.32 v48.26,20.32 | C9.1 59.27,22.61 59.69,23.03 J_RST2.1
  Bottom 0.305: J_PRG2.6 50.8,34.29 48.26,31.75 v48.26,20.32 55.88,20.32 J_RST2.1
RX1  (via drill 0.35)
  Top 0.305: R5.1 v12.7,52.7
  Bottom 0.305: J_PRG_1.5 16.51,17.78 16.51,20.32 13.97,22.86 13.97,29.21 12.7,30.48 v12.7,52.7
SCL  (via drill 0.35)
  Top 0.305: J_QWIIC.4 58.4,44.7 54.48,44.7 53.76,45.43 R23.1 v27.94,46.99 | ESP-12.GPIO5 12.95,42.93 13.97,41.91 v17.78,41.91
  Bottom 0.305: v27.94,46.99 22.86,41.91 v17.78,41.91
SDA  (via drill 0.35)
  Top 0.305: J_QWIIC.3 54.62,43.68 54.61,43.69 53.76,42.84 R24.1 52.07,39.37 46.99,44.45 v27.94,44.45 | ESP-12.GPIO4 14.95,43.47 v15.24,43.18
  Bottom 0.305: v15.24,43.18 15.24,41.91 16.51,40.64 24.13,40.64 v27.94,44.45
SWCLK  (via drill 0.35)
  Top 0.305: STM32C0.19 50.53,30.21 v50.8,30.48 | J_PRG2.4 63.88,30.1 63.88,23.24 J_BOOT2.1
  Bottom 0.305: v50.8,30.48 54.61,30.48 57.15,33.02 60.96,33.02 J_PRG2.4
SWDIO  (via drill 0.35)
  Top 0.305: STM32C0.18 50.45,29.57 v50.8,29.21
  Bottom 0.305: v50.8,29.21 54.61,29.21 56.52,27.3 61.34,27.3 62.23,28.19 J_PRG2.2
T_PWR_SWT  (via drill 0.35)
  Top 0.305: 28.36,65.28 R13.1 27.3,65.41 v26.67,64.77 R14.2 | STM32C0.10 40.26,25.02 v39.37,24.13 39.37,22.86 40.64,21.59 TP9.TP
  Bottom 0.305: v39.37,24.13 35.56,24.13 30.48,29.21 30.48,52.07 25.4,57.15 25.4,63.5 v26.67,64.77
T_RST_SWT  (via drill 0.35)
  Top 0.305: R16.2 v26.67,58.42 27.3,59.05 R15.1 | STM32C0.9 39.63,25.66 v39.37,25.4 38.1,24.13 TP10.TP
  Bottom 0.305: v39.37,25.4 36.83,25.4 31.75,30.48 31.75,53.34 v26.67,58.42
TX1  (via drill 0.35)
  Top 0.305: R4.1 9.95,51.65 v10.16,52.7
  Bottom 0.305: J_PRG_1.3 13.97,17.78 13.97,20.32 12.7,21.59 12.7,27.94 10.16,30.48 v10.16,52.7
VCC_1  (via drill 0.35)
  Top 0.305: C6.1 37.68,27.94 C5.1 | STM32C0.4 39.66,28.91 39.37,29.21 C6.1 | J_QWIIC.2 56.78,42.68 56.39,42.29 v54.99,42.29 | 22.95,26.34 22.86,26.25 | 54.6,11.42 54.61,11.43 | 53.34,35.56 v54.61,36.83 | R8.2 21.59,54.61 26.67,49.53 26.67,43.18 31.11,38.73 | C6.1 37.68,29.88 36.96,30.61 29.34,30.61 29.21,30.48
  Top 0.61: ESP-12.VCC 22.95,26.34 | U$2.B10 54.6,11.42 54.6,12.7 55.88,13.98 55.88,33.02 | J_PRG2.3 58.42,33.02 55.88,33.02 | J_PRG_1.2 10.16,21.59 R1.2 R2.1 14.35,22.9 17.06,22.9 20.41,26.25 C1.1 22.86,26.25 C2.1 25.4,26.25 27.09,27.94 29.21,27.94 29.21,30.48 29.21,36.83 31.11,38.73 31.75,39.37 49.53,39.37 53.34,35.56 55.88,33.02
  Bottom 0.305: v54.61,36.83 54.99,37.21 v54.99,42.29 55.88,43.18 I2C.2
VCC_2  (via drill 0.35)
  Top 0.305: U$2.B8 52.6,9.63 v52.07,10.16 | R3.1 16.3,24.55 v17.14,25.4 | v24.13,55.88 R7.2
  Bottom 0.305: 53.6,6.35 53.6,6.85 54.6,5.85 U$2.A10 | 53.6,6.35 U$2.A9 | v24.13,55.88 29.21,50.8 29.21,31.75 27.94,30.48 17.78,30.48 16.51,29.21 16.51,26.04 v17.14,25.4 17.14,24.77 20.32,21.59 25.4,21.59 27.94,19.05 43.18,19.05 v52.07,10.16 53.59,8.64 53.59,6.36 53.6,6.35
X_PWR_LONG  (via drill 0.35)
  Top 0.305: ESP-12.GPIO13 20.95,28.57 v20.32,27.94 | R12.2 50.59,23.5 48.41,25.66 STM32C0.12 46.24,25.66 45.72,25.15 v45.72,21.59 | v29.21,25.4 v29.21,20.32 | v33.02,20.32 TP8.TP
  Bottom 0.305: v45.72,21.59 44.45,20.32 v33.02,20.32 v29.21,20.32 | v29.21,25.4 24.13,25.4 21.59,27.94 v20.32,27.94
X_PWR_SHRT  (via drill 0.35)
  Top 0.305: ESP-12.GPIO12 19.05,30.44 v19.05,27.94 | R11.2 50.46,25.4 49.54,26.32 STM32C0.13 46,26.32 45.09,25.4 45.09,23.5 v44.45,22.86 | v35.56,22.86 TP7.TP
  Bottom 0.305: v44.45,22.86 v35.56,22.86 29.21,22.86 27.94,24.13 22.86,24.13 v19.05,27.94
X_RST_SHRT  (via drill 0.35)
  Top 0.305: ESP-12.GPIO14 16.95,28.77 v17.78,27.94 | R10.2 50.88,26.96 STM32C0.14 45.76,26.96 44.45,25.65 44.45,24.13 43.18,22.86 v43.18,21.59 | v30.48,21.59 TP6.TP
  Bottom 0.305: v17.78,27.94 17.78,26.67 21.59,22.86 26.67,22.86 27.94,21.59 v30.48,21.59 v43.18,21.59

### Text on the board
tPlace: HA PC Switch | https://c1k.it/hapc
bPlace: https://c1k.it/hapc | HA PC Switch / (c) 2024 / by Vino Rodrigues | Open Source Hardware / Rev B [7 Jun 2024]
tNames: -CI+ | -CI+ | +PW- | -RES+ | +PW- | -RES+ | +PLED- | +HD- | +PLED- | +HD- | Rst> | Pwr>
bNames: -CI+ | BOOT1 | -CI+ | +PWR- | -RST+ | +PWR- | -RST+ | +LED- | +HDD- | +LED- | +HDD- | Pull-ups | RST | CLK | 3V3 | DIO | GND | RST_2 | 3V3 | GND | IO0 | RST_2 | BOOT2 | EN | TX | RX